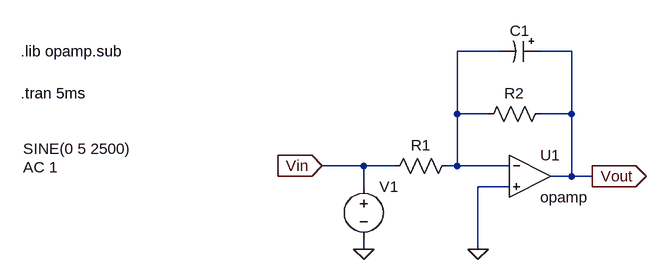
[diagram p0: schematic LP1order.asc]
LP1order.asc, the LTspice schematic file:
Version 4
SHEET 1 880 752
WIRE 352 128 288 128
WIRE 464 128 416 128
WIRE 288 224 288 128
WIRE 336 224 288 224
WIRE 464 224 464 128
WIRE 464 224 416 224
WIRE 144 304 80 304
WIRE 192 304 144 304
WIRE 288 304 288 224
WIRE 288 304 272 304
WIRE 368 304 288 304
WIRE 464 320 464 224
WIRE 464 320 432 320
WIRE 496 320 464 320
WIRE 144 336 144 304
WIRE 368 336 320 336
WIRE 144 432 144 416
WIRE 320 432 320 336
FLAG 320 432 0
FLAG 144 432 0
FLAG 496 320 Vout
IOPIN 496 320 Out
FLAG 80 304 Vin
IOPIN 80 304 In
SYMBOL res 288 288 R90
WINDOW 0 0 56 VBottom 2
WINDOW 3 44 56 Invisible 2
SYMATTR InstName R1
SYMATTR Value 100
SYMATTR SpiceLine tol=1 pwr=0.1
SYMBOL OpAmps\\opamp 400 256 R0
SYMATTR InstName U1
SYMBOL polcap 416 112 R90
WINDOW 0 0 32 VBottom 2
WINDOW 3 32 32 Invisible 2
SYMATTR InstName C1
SYMATTR Value 6.37µ
SYMATTR SpiceLine Irms=0
SYMATTR Description Capacitor
SYMATTR Type cap
SYMBOL res 432 208 R90
WINDOW 0 0 56 VBottom 2
WINDOW 3 32 56 Invisible 2
SYMATTR InstName R2
SYMATTR Value 100
SYMATTR SpiceLine tol=1 pwr=0.1
SYMBOL voltage 144 320 R0
WINDOW 3 -524 -42 Left 2
WINDOW 123 -524 -14 Left 2
WINDOW 39 0 0 Left 0
SYMATTR Value SINE(0 5 2500)
SYMATTR Value2 AC 1
SYMATTR InstName V1
TEXT -384 128 Left 2 !.lib opamp.sub
TEXT -384 192 Left 2 !.tran 5ms

The netlist it stands for:
* LP1order.asc
R1 N001 Vin 100 tol=1 pwr=0.1
XU1 N001 0 Vout opamp Aol=100K GBW=10Meg  ; pins invin noninvin out
C1 Vout N001 6.37µ Irms=0
R2 Vout N001 100 tol=1 pwr=0.1
V1 Vin 0 SINE(0 5 2500) AC 1
.lib opamp.sub
.tran 5ms
.backanno
.end